# EAGLE design Grove - Base Shield for IOIO-OTG (EAGLE 6.4)
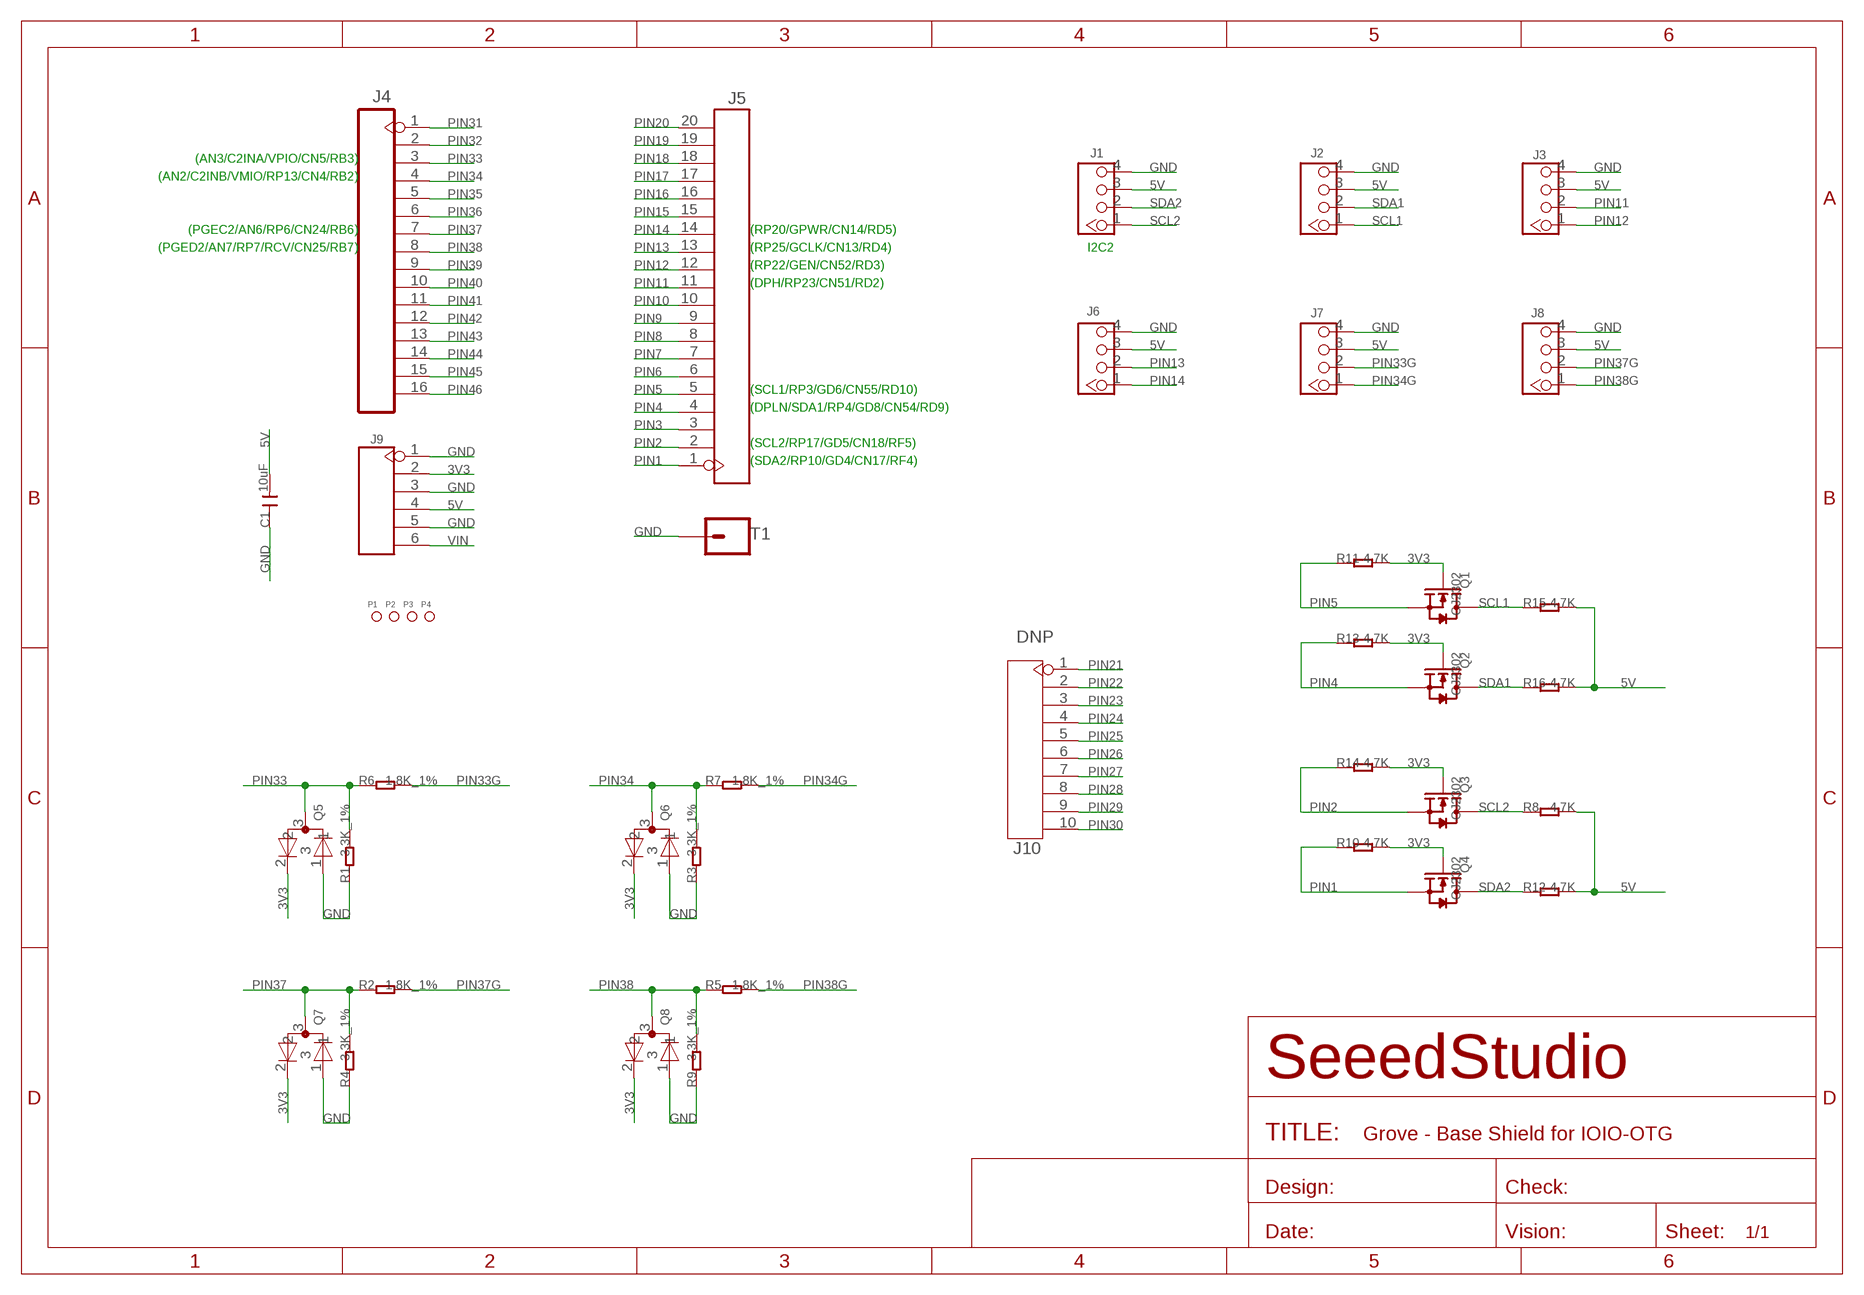
[diagram p0: schematic, sheet 1]

## Parts
C1  10uF  C-0805  [C0805]
J1  TWIG-4P-2.0-2.0  [4P-2.0]
J2  TWIG-4P-2.0-2.0  [4P-2.0]
J3  TWIG-4P-2.0-2.0  [4P-2.0]
J4  HEADER-16P-2.54  [16P-2.54]
J5  HEADER-20P-2.54  [20P-2.54]
J6  TWIG-4P-2.0-2.0  [4P-2.0]
J7  TWIG-4P-2.0-2.0  [4P-2.0]
J8  TWIG-4P-2.0-2.0  [4P-2.0]
J9  HEADER-6P-65/35MIL  [6P-2.54-65/35MIL]
J10  DNP  HEADER-10P-2.54  [10P-2.54]
P1  PAD-MARK  [ROUND-MARK-1.0]
P2  PAD-MARK  [ROUND-MARK-1.0]
P3  PAD-MARK  [ROUND-MARK-1.0]
P4  PAD-MARK  [ROUND-MARK-1.0]
Q1  CJ2302  MOSFET-N'SOT23'  [SOT23]
Q2  CJ2302  MOSFET-N'SOT23'  [SOT23]
Q3  CJ2302  MOSFET-N'SOT23'  [SOT23]
Q4  CJ2302  MOSFET-N'SOT23'  [SOT23]
Q5  BAV99  [SOT23]
Q6  BAV99  [SOT23]
Q7  BAV99  [SOT23]
Q8  BAV99  [SOT23]
R1  3.3K_1%  R-0603  [R0603]
R2  1.8K_1%  R-0603  [R0603]
R3  3.3K_1%  R-0603  [R0603]
R4  3.3K_1%  R-0603  [R0603]
R5  1.8K_1%  R-0603  [R0603]
R6  1.8K_1%  R-0603  [R0603]
R7  1.8K_1%  R-0603  [R0603]
R8  4.7K  R-0603  [R0603]
R9  3.3K_1%  R-0603  [R0603]
R10  4.7K  R-0603  [R0603]
R11  4.7K  R-0603  [R0603]
R12  4.7K  R-0603  [R0603]
R13  4.7K  R-0603  [R0603]
R14  4.7K  R-0603  [R0603]
R15  4.7K  R-0603  [R0603]
R16  4.7K  R-0603  [R0603]
T1  SPARKFUN_M01PTH  [SPARKFUN_1X01]

## Nets
3V3: J9.2 Q1.1(G) Q2.1(G) Q3.1(G) Q4.1(G) Q5.2 Q6.2 Q7.2 Q8.2 R10.2 R11.2 R13.2 R14.2
5V: C1.2 J1.3 J2.3 J3.3 J6.3 J7.3 J8.3 J9.4 R8.2 R12.2 R15.2 R16.2
GND: C1.1 J1.4 J2.4 J3.4 J6.4 J7.4 J8.4 J9.1 J9.3 J9.5 Q5.1 Q6.1 Q7.1 Q8.1 R1.1 R3.1 R4.1 R9.1 T1.1
PIN1: J5.1 Q4.2(S) R10.1
PIN2: J5.2 Q3.2(S) R14.1
PIN3: J5.3
PIN4: J5.4 Q2.2(S) R13.1
PIN5: J5.5 Q1.2(S) R11.1
PIN6: J5.6
PIN7: J5.7
PIN8: J5.8
PIN9: J5.9
PIN10: J5.10
PIN11: J3.2 J5.11
PIN12: J3.1 J5.12
PIN13: J5.13 J6.2
PIN14: J5.14 J6.1
PIN15: J5.15
PIN16: J5.16
PIN17: J5.17
PIN18: J5.18
PIN19: J5.19
PIN20: J5.20
PIN21: J10.1
PIN22: J10.2
PIN23: J10.3
PIN24: J10.4
PIN25: J10.5
PIN26: J10.6
PIN27: J10.7
PIN28: J10.8
PIN29: J10.9
PIN30: J10.10
PIN31: J4.1
PIN32: J4.2
PIN33: J4.3 Q5.3 R1.2 R6.1
PIN33G: J7.2 R6.2
PIN34: J4.4 Q6.3 R3.2 R7.1
PIN34G: J7.1 R7.2
PIN35: J4.5
PIN36: J4.6
PIN37: J4.7 Q7.3 R2.1 R4.2
PIN37G: J8.2 R2.2
PIN38: J4.8 Q8.3 R5.1 R9.2
PIN38G: J8.1 R5.2
PIN39: J4.9
PIN40: J4.10
PIN41: J4.11
PIN42: J4.12
PIN43: J4.13
PIN44: J4.14
PIN45: J4.15
PIN46: J4.16
SCL1: J2.1 Q1.3(D) R15.1
SCL2: J1.1 Q3.3(D) R8.1
SDA1: J2.2 Q2.3(D) R16.1
SDA2: J1.2 Q4.3(D) R12.1
VIN: J9.6

## Notes on the sheet
- (AN3/C2INA/VPIO/CN5/RB3)
- (AN2/C2INB/VMIO/RP13/CN4/RB2)
- (PGEC2/AN6/RP6/CN24/RB6)
- (RP20/GPWR/CN14/RD5)
- (PGED2/AN7/RP7/RCV/CN25/RB7)
- (RP25/GCLK/CN13/RD4) | I2C2
- (RP22/GEN/CN52/RD3)
- (DPH/RP23/CN51/RD2)
- (SCL1/RP3/GD6/CN55/RD10)
- (DPLN/SDA1/RP4/GD8/CN54/RD9)
- (SCL2/RP17/GD5/CN18/RF5)
- (SDA2/RP10/GD4/CN17/RF4)

## Library data of the parts
C1 = Discrete:C*: Ceramic Capacitors
J1-J3 J6-J8 = Connector:TWIG-4P-2.0
J4 = Connector:HEADER-16P
J5 = Connector:HEADER-20P
J9 = Connector:HEADER-6P
J10 = Connector:HEADER-10P
P1-P4 = Discrete:PAD-MARK; PARTNO: DNP
Q1-Q4 = Discrete:MOSFET-N: IRLL014: http://www.vishay.com/docs/91319/sihll014.pdf
Q5-Q8 = template:BAV99
R1-R16 = Discrete:R*
T1 = IOIO-OTG-v20:SPARKFUN_M01: Header 1 Standard 1-pin 0.1" header. Use with straight break away headers (SKU : PRT-00116), right angle break away headers (PRT-00553), swiss pins (PRT-00743), machine pins (PRT-00117), and female headers (PRT-00115).

## Board
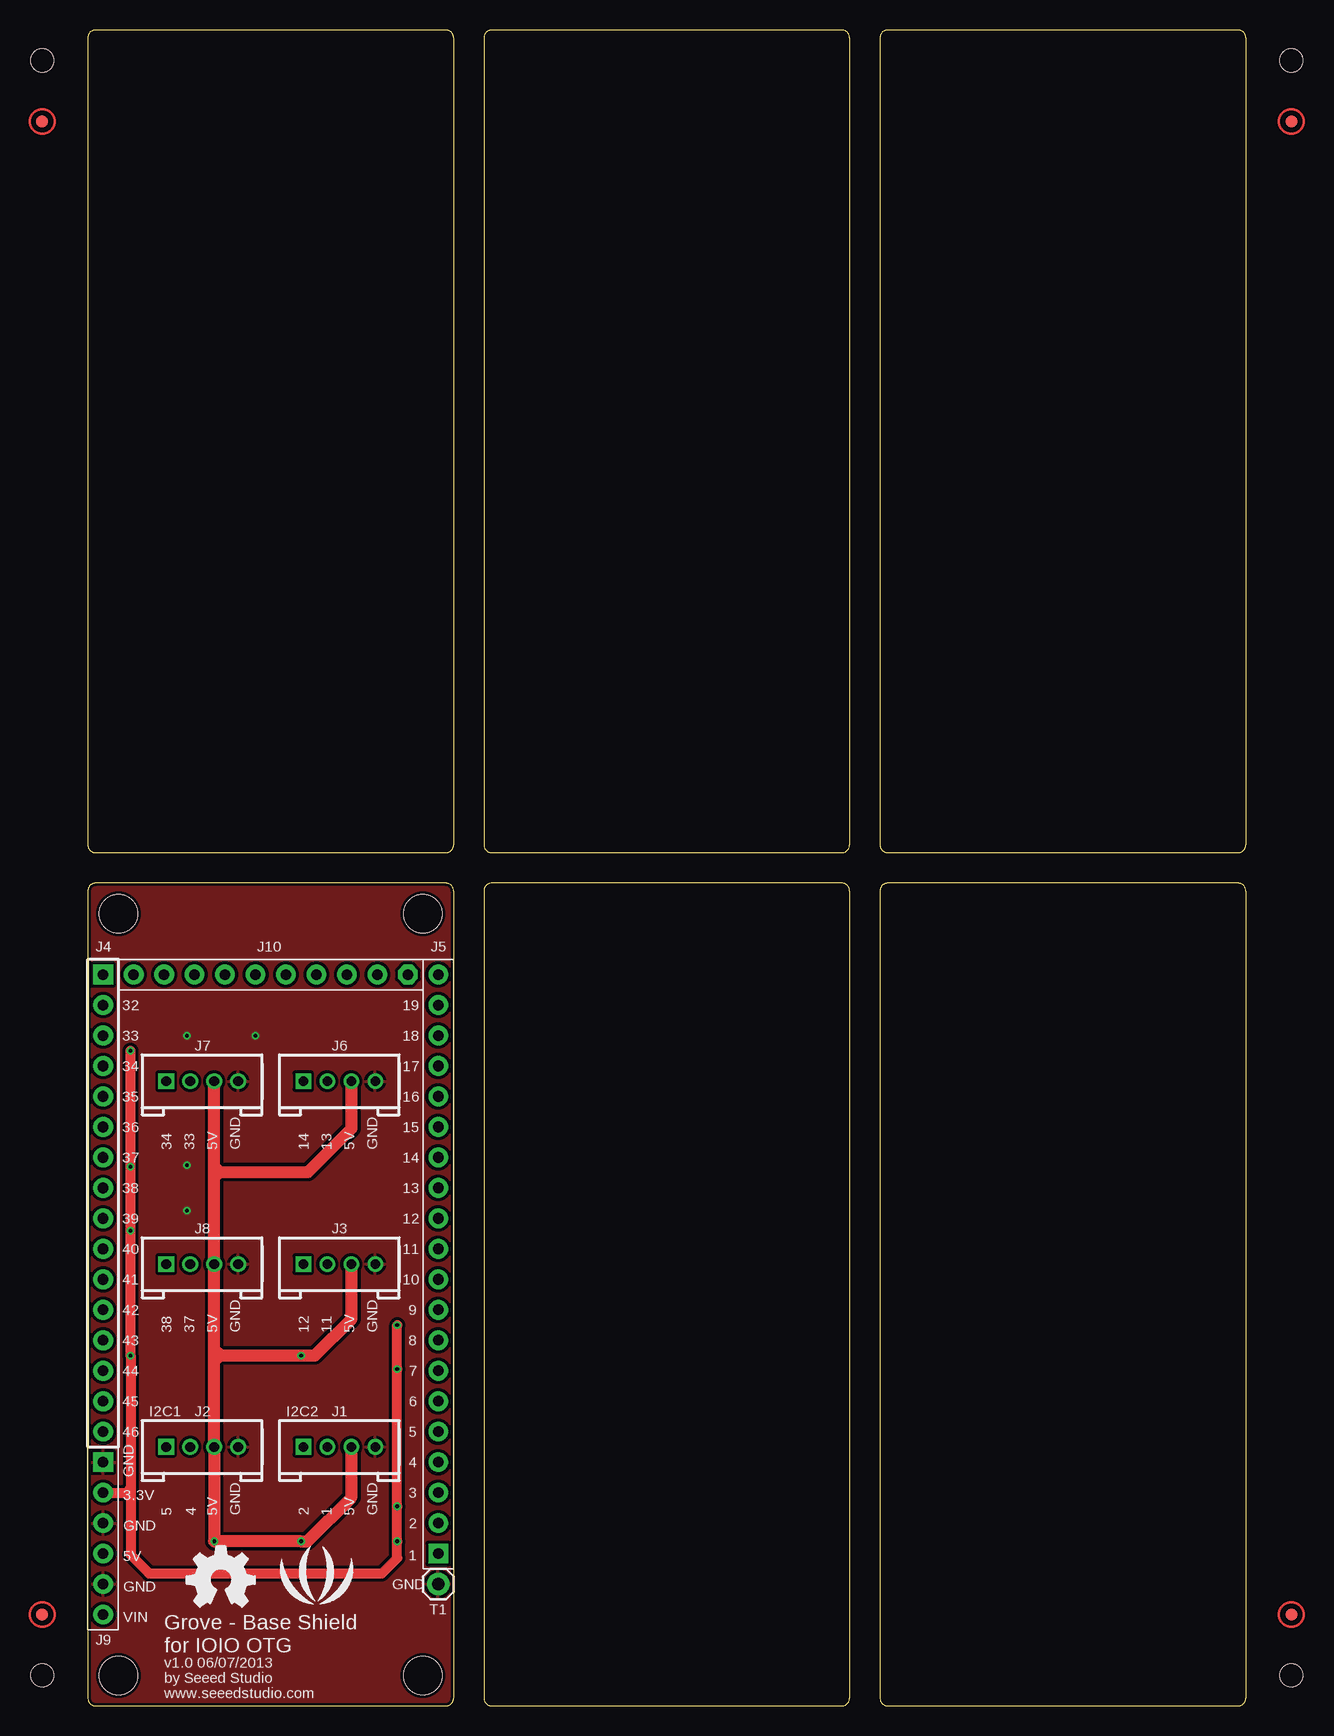
[diagram p1: board, top side]
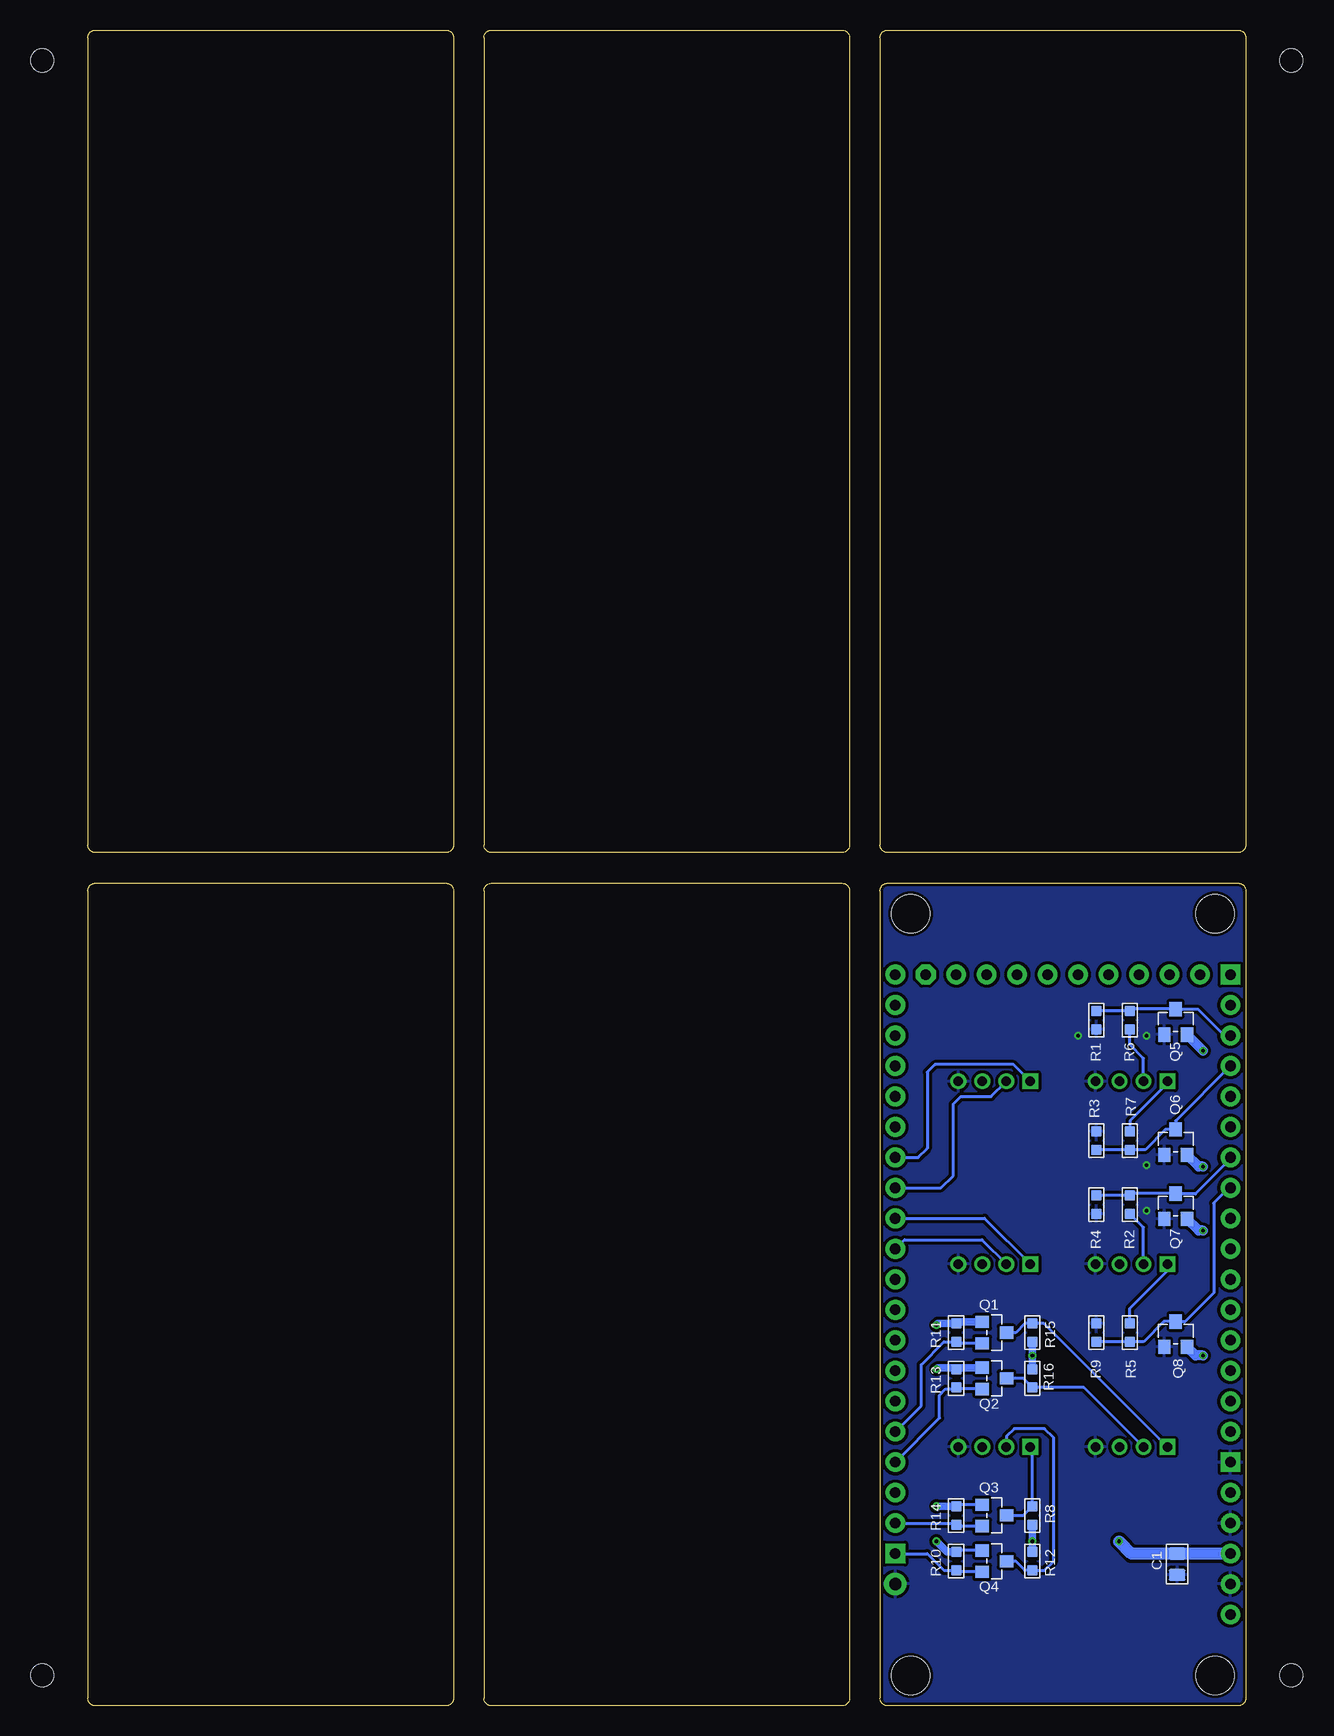
[diagram p2: board, bottom side, seen from below]

Size 96.52 x 139.7 mm. Coordinates in mm from the lower left corner, seen from the top.
Outline: 0.64,68.58 arc90 0,67.94
Outline: 0,67.94 0,0.64
Outline: 0,0.64 arc90 0.64,0
Outline: 29.84,0 arc90 30.48,0.64
Outline: 30.48,67.94 arc90 29.84,68.58
Outline: 29.84,68.58 0.64,68.58
Outline: 0.64,68.58 arc90 0,67.94
Outline: 0,0.64 arc90 0.64,0
Outline: 0.64,0 29.84,0
Outline: 29.84,0 arc90 30.48,0.64
Outline: 30.48,67.94 arc90 29.84,68.58
Outline: 30.48,67.94 30.48,0.64
Outline: 95.89,139.7 66.67,139.7 arc90 66.04,139.06 66.04,71.75 arc90 66.67,71.12 95.89,71.12 arc90 96.52,71.75 96.52,139.06 arc90 95.89,139.7
Outline: 62.87,139.7 33.66,139.7 arc90 33.02,139.06 33.02,71.75 arc90 33.66,71.12 62.87,71.12 arc90 63.5,71.75 63.5,139.06 arc90 62.87,139.7
Outline: 29.84,139.7 0.64,139.7 arc90 0,139.06 0,71.75 arc90 0.64,71.12 29.84,71.12 arc90 30.48,71.75 30.48,139.06 arc90 29.84,139.7
Outline: 95.89,68.58 66.67,68.58 arc90 66.04,67.94 66.04,0.64 arc90 66.67,0 95.89,0 arc90 96.52,0.64 96.52,67.94 arc90 95.89,68.58
Outline: 62.87,68.58 33.66,68.58 arc90 33.02,67.94 33.02,0.64 arc90 33.66,0 62.87,0 arc90 63.5,0.64 63.5,67.94 arc90 62.87,68.58
Copper layers (1*16): Top 0.035mm / dielectric 1.5mm / Bottom 0.035mm
Design rules "SeeedStudio_rule_no_angle_090911 *": minimum track width 6mil, minimum drill 12mil, track to track 6mil, track to pad 6mil, pad to pad 6mil, via to via 6mil, smd to smd 0mil, copper to edge 10mil, drill to drill 10mil, minimum pad ring 10mil, minimum via ring 6mil, stop-mask expansion 2mil, vias tented up to drill 100mil, thermal gap 10mil
Holes 3.2 mm at 2.54,2.54 27.94,2.54 2.54,66.04 27.94,66.04
Holes 1.91 mm at -3.81,2.54 100.33,2.54 100.33,137.16 -3.81,137.16

### Footprints (pad centres in the part's own frame; a part is rotated, then mirrored left to right if it is on the bottom)
C0805 = smd 1.016 x 1.397: 1 -0.889,0; 2 0.889,0
4P-2.0 = drill 0.8 pad 1.27 square: 1 -3,0 | drill 0.8 pad 1.27: 2 -1,0; 3 1,0; 4 3,0
16P-2.54 = drill 0.889 pad 1.651 square: 1 -19.05,0 | drill 0.889 pad 1.651: 2 -16.51,0; 3 -13.97,0; 4 -11.43,0; 5 -8.89,0; 6 -6.35,0; 7 -3.81,0; 8 -1.27,0; 9 1.27,0; 10 3.81,0; 11 6.35,0; 12 8.89,0; 13 11.43,0; 14 13.97,0; 15 16.51,0; 16 19.05,0
20P-2.54 = drill 0.889 pad 1.651 square: 1 -25.4,0 | drill 0.889 pad 1.651: 2 -22.86,0; 3 -20.32,0; 4 -17.78,0; 5 -15.24,0; 6 -12.7,0; 7 -10.16,0; 8 -7.62,0; 9 -5.08,0; 10 -2.54,0; 11 0,0; 12 2.54,0; 13 5.08,0; 14 7.62,0; 15 10.16,0; 16 12.7,0; 17 15.24,0; 18 17.78,0; 19 20.32,0; 20 22.86,0
6P-2.54-65/35MIL = drill 0.889 pad 1.651 square: 1 0,6.35 | drill 0.889 pad 1.651: 2 0,3.81; 3 0,1.27; 4 0,-1.27; 5 0,-3.81; 6 0,-6.35
10P-2.54 = drill 0.889 pad 1.651 octagon: 1 0,11.43 | drill 0.889 pad 1.651: 2 0,8.89; 3 0,6.35; 4 0,3.81; 5 0,1.27; 6 0,-1.27; 7 0,-3.81; 8 0,-6.35; 9 0,-8.89; 10 0,-11.43
ROUND-MARK-1.0 = smd 1.016 x 1.016: P$1 0,0
SOT23 = smd 1.016 x 1.143: 1 -0.889,-1.016; 2 0.889,-1.016; 3 0,1.016
SOT23' = smd 1.016 x 1.2: 1 -0.95,-1.06; 2 0.95,-1.06; 3 0,1.06
R0603 = smd 0.889 x 0.889: 1 -0.762,0; 2 0.762,0
SPARKFUN_1X01 = drill 1.016 pad 1.88: 1 0,0

### Placement (x,y rotation side)
C1  5.71,11.81 90 bottom
J1  20.95,21.59 0 top
J2  9.53,21.59 0 top
J3  20.95,36.83 0 top
J4  1.27,41.91 270 top
J5  29.21,38.1 90 top
J6  20.95,52.07 0 top
J7  9.53,52.07 0 top
J8  9.53,36.83 0 top
J9  1.27,13.97 0 top
J10  15.24,60.96 270 top
P1  -3.81,7.62 0 top  (outside the outline)
P2  100.33,7.62 0 top  (outside the outline)
P3  -3.81,132.08 0 top  (outside the outline)
P4  100.33,132.08 0 top  (outside the outline)
Q1  20.95,31.11 270 bottom
Q2  20.95,27.3 270 bottom
Q3  20.95,15.88 270 bottom
Q4  20.95,12.06 270 bottom
Q5  [SOT23']  5.84,57.02 0 bottom
Q6  [SOT23']  5.84,46.99 0 bottom
Q7  [SOT23']  5.84,41.66 0 bottom
Q8  [SOT23']  5.84,30.99 0 bottom
R1  12.45,57.15 90 bottom
R2  9.65,41.78 270 bottom
R3  12.45,47.12 270 bottom
R4  12.45,41.78 90 bottom
R5  9.65,31.11 90 bottom
R6  9.65,57.15 270 bottom
R7  9.65,47.12 90 bottom
R8  17.78,15.88 270 bottom
R9  12.45,31.11 270 bottom
R10  24.13,12.06 90 bottom
R11  24.13,31.11 90 bottom
R12  17.78,12.06 90 bottom
R13  24.13,27.3 90 bottom
R14  24.13,15.88 90 bottom
R15  17.78,31.11 270 bottom
R16  17.78,27.3 90 bottom
T1  29.21,10.16 0 top
U$2  [LOGO_SILK]  19.05,10.16 0 top
U$3  [OSHW_FILLX200_NOTEXT]  8.26,8.26 0 top

### Tracks (layer width: path | path; a pad name or v marks a point on that pad's centre or on a via)
3V3  (via drill 0.3 pad 0.64)
  Top 0.813: 3.56,18.16 v3.56,29.21 v3.56,39.62 v3.56,44.96 v3.56,54.61 | 3.56,18.16 3.56,17.91 | 3.56,17.91 3.56,17.4 | 3.56,17.4 3.56,12.6 5.11,11.05 24.51,11.05 25.78,12.32 v25.78,13.72 v25.78,16.64 v25.78,28.07 v25.78,31.75 | J9.2 3.17,17.78 | 3.17,17.78 3.43,17.78 3.56,17.91 | 3.17,17.78 3.56,18.16 | 3.17,17.78 3.56,17.4
  Bottom 0.254: 24,32 R11.2 | 24,28.19 R13.2 | Q3.1 24,16.76 R14.2 | Q4.1 24,12.95 R10.2
  Bottom 0.61: R11.2 25.65,31.88 v25.78,31.75 | v25.78,13.72 24.89,12.83 R10.2 | R14.2 v25.78,16.64 | v25.78,28.07 25.65,28.19 24,28.19 Q2.1 | 24,32 Q1.1
  Bottom 0.813: v3.56,54.61 3.56,54.63 Q5.2 | v3.56,29.21 4.17,29.21 Q8.2 | v3.56,44.96 3.92,44.96 Q6.2 | v3.56,39.62 3.92,39.62 Q7.2
5V  (via drill 0.3 pad 0.64)
  Top 1.016: J2.3 10.53,28.88 | 10.53,28.88 J8.3 10.53,44.51 | 10.53,44.51 J7.3 | 10.53,44.51 10.98,44.51 | 10.99,44.51 18.34,44.51 21.97,48.13 21.97,52.05 J6.3 | J3.3 21.97,36.81 21.97,32.26 18.92,29.21 v17.78,29.21 11.05,29.21 | 10.54,21.57 J2.3 | J1.3 21.97,21.57 21.97,17.4 18.29,13.72 v17.78,13.72 11.43,13.72 10.92,13.72 | 10.53,28.88 10.86,29.21 11.05,29.21 | 10.41,21.48 J2.3 | 10.99,44.51 10.54,44.96 | 10.99,44.51 10.98,44.51 | 10.98,44.51 10.54,44.07 | 11.05,29.21 10.54,29.72 | 11.05,29.21 10.54,28.7 | J2.3 10.53,13.73 v10.54,13.72 10.92,13.72 | 10.92,13.72 10.54,14.1
  Bottom 0.61: R15.2 17.88,30.25 17.91,30.25 17.78,30.13 v17.78,29.21 R16.2 | R8.2 v17.78,13.72 R12.2
  Bottom 1.016: J9.4 C1.2 9.02,12.7 9.27,12.7 9.53,12.7 v10.54,13.72
GND  (via drill 0.3 pad 0.64)
  other vias: 8.26,45.09 8.26,41.27 8.26,55.88 13.97,55.88
  pour Bottom (isolate 0.254, rank 6): 0,0 30.48,0 30.48,68.58 0,68.58 0,0.13
  pour Top (isolate 0.254, rank 6): 0,0 30.48,0 30.48,68.58 0,68.58 0,0.13
PIN1
  Bottom 0.254: J5.1 26.54,12.7 25.15,11.3 R10.1 24,11.18 Q4.2
PIN2
  Bottom 0.254: J5.2 24.26,15.24 R14.1 24,14.99 Q3.2
PIN4
  Bottom 0.254: Q2.2 24,26.42 R13.1 24.26,26.42 25.02,26.42 25.53,25.91 25.53,24 J5.4
PIN5
  Bottom 0.254: Q1.2 24,30.23 R11.1 25.15,30.35 27.05,28.45 27.05,25.02 J5.5
PIN11
  Bottom 0.254: J5.11 28.45,38.86 21.99,38.86 J3.2
PIN12
  Bottom 0.254: J5.12 21.77,40.64 J3.1
PIN13
  Bottom 0.254: J6.2 21.23,50.8 23.75,50.8 24.38,50.16 24.38,44.2 25.4,43.18 J5.13
PIN14
  Bottom 0.254: J6.1 19.35,53.47 25.91,53.47 26.54,52.83 26.54,46.48 27.3,45.72 J5.14
PIN33
  Bottom 0.254: R1.2 R6.1 9.48,58.08 Q5.3 5.8,58.04 3.94,58.04 1.78,55.88 J4.3
PIN33G
  Bottom 0.254: J7.2 8.53,53.99 9.65,55.12 R6.2
PIN34
  Bottom 0.254: R3.2 R7.1 8.38,46.35 6.69,48.05 Q6.3 5.84,48.77 J4.4
PIN34G
  Bottom 0.254: J7.1 6.53,51.9 9.65,48.77 R7.2
PIN37
  Bottom 0.254: R4.2 R2.1 9.48,42.72 Q7.3 5.8,42.67 4.19,42.67 1.14,45.72 J4.7
PIN37G
  Bottom 0.254: J8.2 8.53,39.89 R2.2
PIN38
  Bottom 0.254: R9.2 R5.1 8.51,30.35 6.81,32.05 Q8.3 5.8,32 5.08,32 2.67,34.42 2.67,41.91 1.4,43.18 J4.8
PIN38G
  Bottom 0.254: R5.2 9.65,33.15 6.53,36.27 J8.1
SCL1
  Bottom 0.254: Q1.3 19.18,31.11 18.41,31.88 R15.1 16.81,31.88 J2.1
SCL2
  Bottom 0.254: J1.1 17.78,21.41 R8.1 18.54,15.88 Q3.3
SDA1
  Bottom 0.254: J2.2 13.48,26.54 R16.1 18.54,27.3 Q2.3
SDA2
  Bottom 0.254: Q4.3 19.18,12.06 18.41,11.3 R12.1 16.76,11.3 16,12.06 16,22.35 16.76,23.11 19.3,23.11 19.94,22.48 19.94,21.61 J1.2

### Text on the board
tPlace: 32 | 19 | 33 | 18 | 34 | 17 | 35 | 16 | 36 | 15 | 34 | 33 | 5V | GND | 14 | 13 | 5V | GND | 37 | 14 | 38 | 13 | 39 | 12 | 40 | 11 | 41 | 10 | 42 | 9 | 38 | 37 | 5V | GND | 12 | 11 | 5V | GND | 43 | 8 | 44 | 7 | 45 | 6 | I2C1 | I2C2 | 46 | 5 | 4 | GND | 3.3V | 3 | 5 | 4 | 5V | GND | 2 | 1 | 5V | GND | GND | 2 | 5V | 1 | GND | GND | VIN | Grove - Base Shield / for IOIO OTG | v1.0 06/07/2013 | by Seeed Studio | www.seeedstudio.com